# EAGLE design 3yp_node (EAGLE 9.5.2)
DOC_NUM: 1; REV: 1A
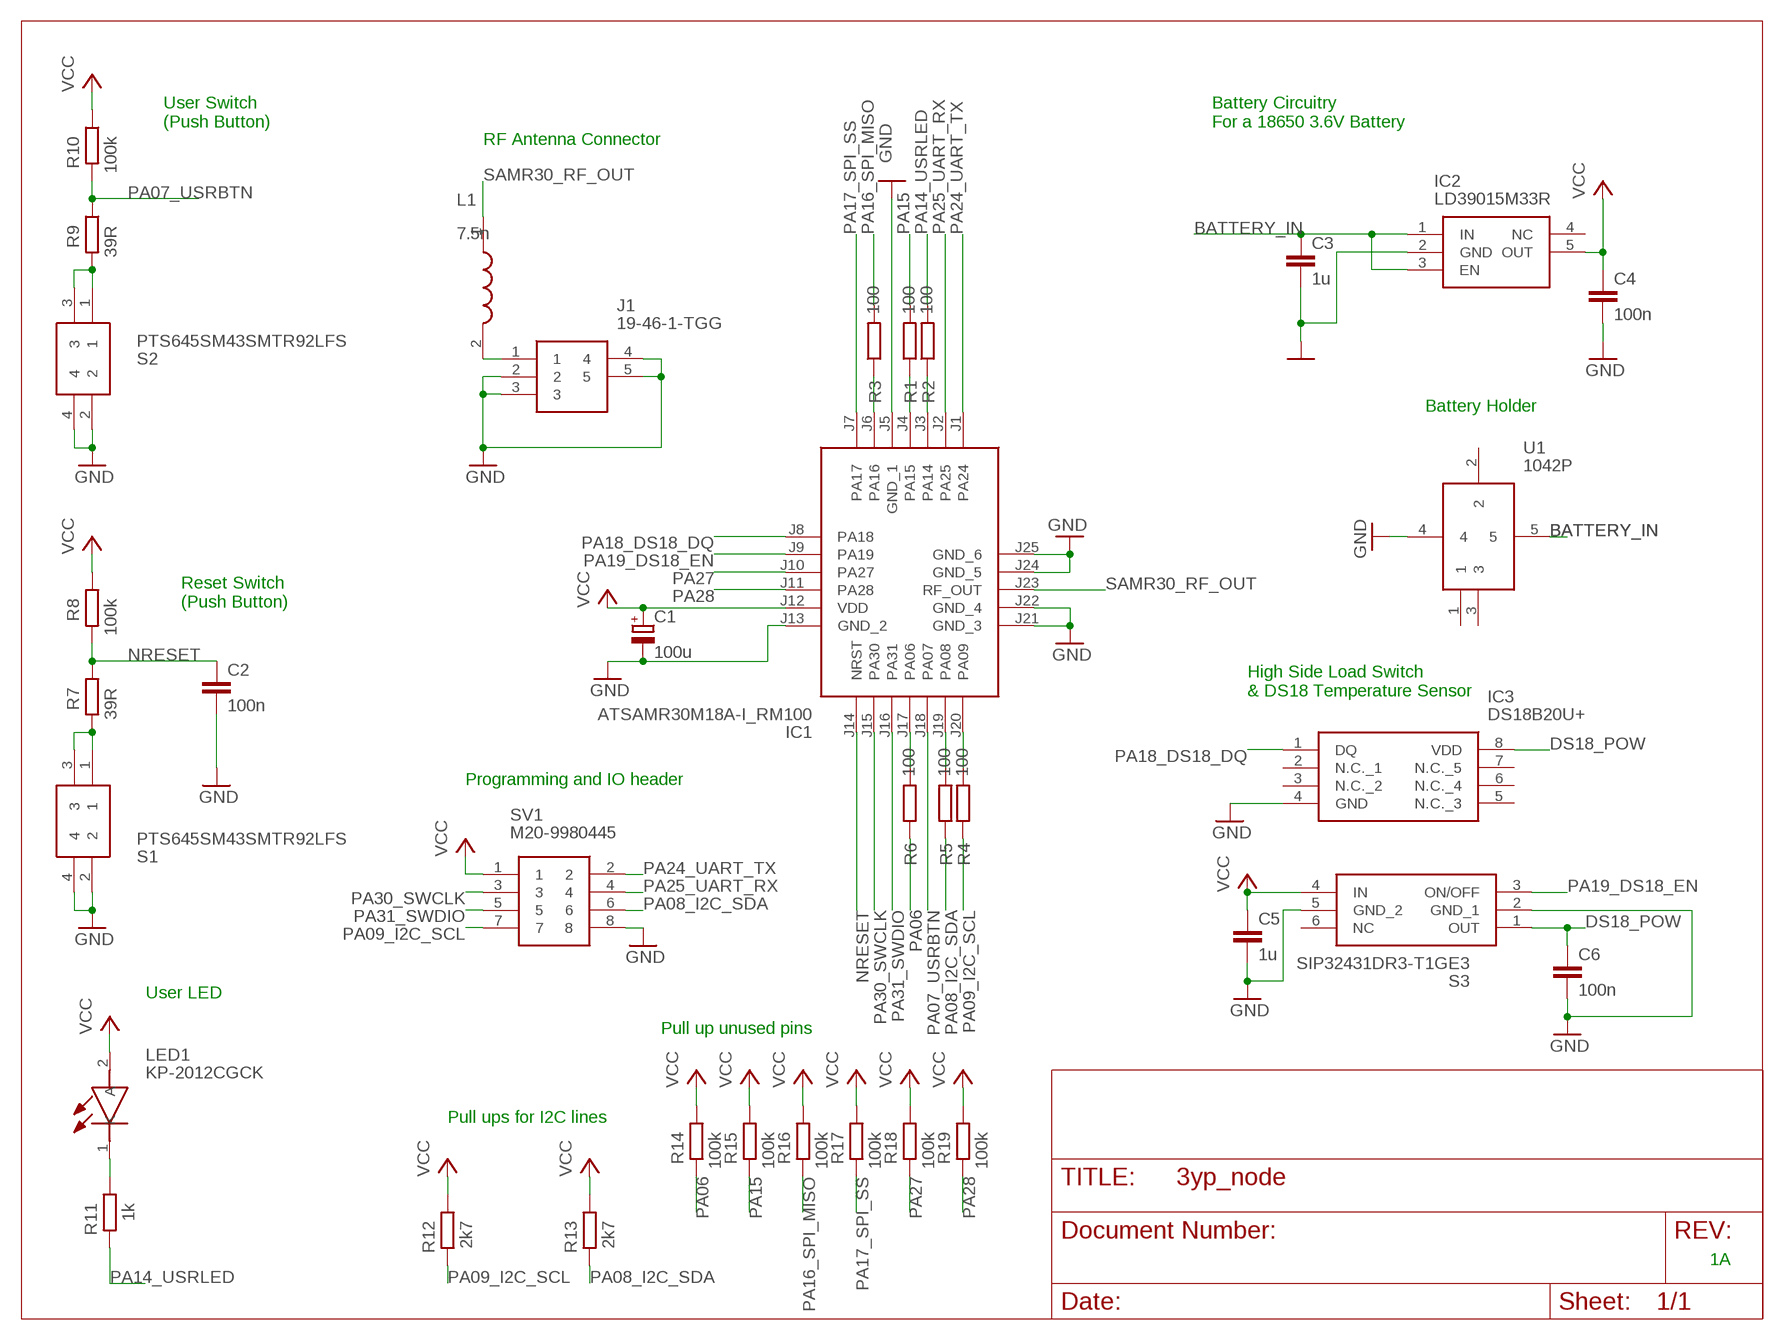
[diagram p0: schematic, sheet 1]

## Parts
C1  100u  CPOL-EUA/3216-18W  [A/3216-18W]
C2  100n  C-EUC0805  [C0805]
C3  1u  C-EUC0805  [C0805]
C4  100n  C-EUC0805  [C0805]
C5  1u  C-EUC0805  [C0805]
C6  100n  C-EUC0805  [C0805]
IC1  ATSAMR30M18A-I_RM100  [ATSAMR30M18AIRM100]
IC2  LD39015M33R  [SOT95P280X145-5N]
IC3  DS18B20U+  [SOP65P490X110-8N]
J1  19-46-1-TGG  [19-46-1-TGG_1]
L1  7.5n  MHQ1005P10NJT  [INDC1006X60N]
LED1  KP-2012CGCK  [LEDC2012X110N]
R1  100  R-EU_R0603  [R0603]
R2  100  R-EU_R0603  [R0603]
R3  100  R-EU_R0603  [R0603]
R4  100  R-EU_R0603  [R0603]
R5  100  R-EU_R0603  [R0603]
R6  100  R-EU_R0603  [R0603]
R7  39R  R-EU_R0603  [R0603]
R8  100k  R-EU_R0603  [R0603]
R9  39R  R-EU_R0603  [R0603]
R10  100k  R-EU_R0603  [R0603]
R11  1k  R-EU_R0603  [R0603]
R12  2k7  R-EU_R0603  [R0603]
R13  2k7  R-EU_R0603  [R0603]
R14  100k  R-EU_R0603  [R0603]
R15  100k  R-EU_R0603  [R0603]
R16  100k  R-EU_R0603  [R0603]
R17  100k  R-EU_R0603  [R0603]
R18  100k  R-EU_R0603  [R0603]
R19  100k  R-EU_R0603  [R0603]
S1  PTS645SM43SMTR92LFS  [PTS645(SMT)]
S2  PTS645SM43SMTR92LFS  [PTS645(SMT)]
S3  SIP32431DR3-T1GE3  [SOT65P210X110-6N]
SV1  M20-9980445  [HDRV8W64P254_2X4_1016X508X868P]
U1  1042P  [1042P]

## Nets
BATTERY_IN: C3.1 IC2.1(IN) IC2.3(EN) U1.5
DS18_POW: C6.1 IC3.8(VDD) S3.1(OUT)
GND: C1.- C2.2 C3.2 C4.2 C5.2 C6.2 IC1.J5(GND_1) IC1.J13(GND_2) IC1.J21(GND_3) IC1.J22(GND_4) IC1.J24(GND_5) IC1.J25(GND_6) IC2.2(GND) IC3.4(GND) J1.2 J1.3 J1.4 J1.5 S1.2 S1.4 S2.2 S2.4 S3.2(GND_1) S3.5(GND_2) SV1.8 U1.4
N$1: R9.2 S2.1 S2.3
N$2: IC1.J4(PA15) R1.1
N$3: IC1.J6(PA16) R3.1
N$4: IC1.J3(PA14) R2.1
N$5: IC1.J17(PA06) R6.2
N$6: IC1.J19(PA08) R5.2
N$7: IC1.J20(PA09) R4.2
N$8: R7.2 S1.1 S1.3
N$9: LED1.1(K) R11.1
N$10: J1.1 L1.2
NRESET: C2.1 IC1.J14(NRST) R7.1 R8.2
PA06: R6.1 R14.2
PA07_USRBTN: IC1.J18(PA07) R9.1 R10.2
PA08_I2C_SDA: R5.1 R13.2 SV1.6
PA09_I2C_SCL: R4.1 R12.2 SV1.7
PA14_USRLED: R2.2 R11.2
PA15: R1.2 R15.2
PA16_SPI_MISO: R3.2 R16.2
PA17_SPI_SS: IC1.J7(PA17) R17.2
PA18_DS18_DQ: IC1.J8(PA18) IC3.1(DQ)
PA19_DS18_EN: IC1.J9(PA19) S3.3(ON/OFF)
PA24_UART_TX: IC1.J1(PA24) SV1.2
PA25_UART_RX: IC1.J2(PA25) SV1.4
PA27: IC1.J10(PA27) R18.2
PA28: IC1.J11(PA28) R19.2
PA30_SWCLK: IC1.J15(PA30) SV1.3
PA31_SWDIO: IC1.J16(PA31) SV1.5
SAMR30_RF_OUT: IC1.J23(RF_OUT) L1.1
VCC: C1.+ C4.1 C5.1 IC1.J12(VDD) IC2.5(OUT) LED1.2(A) R8.1 R10.1 R12.1 R13.1 R14.1 R15.1 R16.1 R17.1 R18.1 R19.1 S3.4(IN) SV1.1
Unconnected: IC2.4(NC) IC3.2(N.C._1) IC3.3(N.C._2) IC3.5(N.C._3) IC3.6(N.C._4) IC3.7(N.C._5) S3.6(NC) U1.1 U1.2 U1.3

## Notes on the sheet
- User Switch
  (Push Button)
- Battery Circuitry
  For a 18650 3.6V Battery
- RF Antenna Connector
- Battery Holder
- Reset Switch 
  (Push Button)
- High Side Load Switch
  & DS18 Temperature Sensor
- Programming and IO header
- User LED
- Pull up unused pins
- Pull ups for I2C lines

## Library data of the parts
C1 = rcl:CPOL-EU: POLARIZED CAPACITOR, European symbol; SPICEPREFIX: C
C2-C6 = rcl:C-EU: CAPACITOR, European symbol; SPICEPREFIX: C
IC1 = SamacSys_Parts:ATSAMR30M18A-I_RM100: Microchip Technology, ATSAMR30M18A-I/RM1 Source: Datasheet <http://www.mouser.com/datasheet/2/268/70005384A-1532404.pdf>; DESCRIPTION: Microchip Technology, ATSAMR30M18A-I/RM1; HEIGHT: 2.1mm; MANUFACTURER_NAME: Microchip; MANUFACTURER_PART_NUMBER: ATSAMR30M18A-I/RM100; MOUSER_PART_NUMBER: 556-AMR30M18AIRM100; MOUSER_PRICE-STOCK: https://www.mouser.com/Search/Refine.aspx?Keyword=556-AMR30M18AIRM100; RS_PART_NUMBER: 1840450; RS_PRICE-STOCK: http://uk.rs-online.com/web/p/products/1840450
IC2 = SamacSys_Parts:LD39015M33R: LD39015M33R, Low Dropout Voltage Regulator, 150mA, 3.3 V +/-2%, 1.5 5.5 Vin, 5-Pin SOT-23 Source: Datasheet <http://www.st.com/web/en/resource/technical/document/datasheet/CD00173477.pdf>; ALLIED_NUMBER: 70521225; ALLIED_PRICE-STOCK: http://www.alliedelec.com/stmicroelectronics-ld39015m33r/70521225/; DESCRIPTION: LD39015M33R, Low Dropout Voltage Regulator, 150mA, 3.3 V +/-2%, 1.5 5.5 Vin, 5-Pin SOT-23; HEIGHT: 1.45mm; MANUFACTURER_NAME: STMicroelectronics; MANUFACTURER_PART_NUMBER: LD39015M33R; MOUSER_PART_NUMBER: 511-LD39015M33R; MOUSER_PRICE-STOCK: https://www.mouser.com/Search/Refine.aspx?Keyword=511-LD39015M33R; RS_PART_NUMBER: 7958965P; RS_PRICE-STOCK: http://uk.rs-online.com/web/p/products/7958965P
IC3 = SamacSys_Parts:DS18B20U+: Board Mount Temperature Sensors Prgmble Resolution 1-Wire Parasite Pwr Source: Datasheet <https://componentsearchengine.com/Datasheets/1/DS18B20U .pdf>; DESCRIPTION: Board Mount Temperature Sensors Prgmble Resolution 1-Wire Parasite Pwr; HEIGHT: 1.1mm; MANUFACTURER_NAME: Maxim Integrated; MANUFACTURER_PART_NUMBER: DS18B20U+; MOUSER_PART_NUMBER: 700-DS18B20U; MOUSER_PRICE-STOCK: https://www.mouser.com/Search/Refine.aspx?Keyword=700-DS18B20U
J1 = SamacSys_Parts:19-46-1-TGG: MULTICOMP - 19-46-1-TGG - RF COAXIAL, SMA, STRAIGHT JACK, 50OHM Source: Datasheet <http://www.farnell.com/datasheets/1661858.pdf>; DESCRIPTION: MULTICOMP - 19-46-1-TGG - RF COAXIAL, SMA, STRAIGHT JACK, 50OHM; HEIGHT: mm; MANUFACTURER_NAME: MULTICOMP; MANUFACTURER_PART_NUMBER: 19-46-1-TGG
L1 = SamacSys_Parts:MHQ1005P10NJT: TDK MHQ1005P Series 10 nH +/-5% Ceramic Multilayer SMD Inductor, 0402 Case, SRF: 4.6GHz Q: 23 500mA dc 190m Rdc Source: Datasheet <https://product.tdk.com/info/en/catalog/datasheets/inductor_commercial_high-frequency_mhq1005p_en.pdf>; DESCRIPTION: TDK MHQ1005P Series 10 nH +/-5% Ceramic Multilayer SMD Inductor, 0402 Case, SRF: 4.6GHz Q: 23 500mA dc 190m Rdc; HEIGHT: 0.6mm; MANUFACTURER_NAME: TDK; MANUFACTURER_PART_NUMBER: MHQ1005P10NJT; MOUSER_PART_NUMBER: 810-MHQ1005P10NJT; MOUSER_PRICE-STOCK: https://www.mouser.com/Search/Refine.aspx?Keyword=810-MHQ1005P10NJT; RS_PART_NUMBER: 7958243P; RS_PRICE-STOCK: http://uk.rs-online.com/web/p/products/7958243P
LED1 = SamacSys_Parts:KP-2012CGCK: Green Chip LED 2.0x1.25mm Kingbright KP-2012CGCK Green LED, 570 nm, 2012 (0805), Rectangle Lens SMD Package Source: Datasheet <https://componentsearchengine.com/Datasheets/2/KP-2012CGCK.pdf>; DESCRIPTION: Green Chip LED 2.0x1.25mm Kingbright KP-2012CGCK Green LED, 570 nm, 2012 (0805), Rectangle Lens SMD Package; HEIGHT: 1.1mm; MANUFACTURER_NAME: Kingbright; MANUFACTURER_PART_NUMBER: KP-2012CGCK; MOUSER_PART_NUMBER: N/A; MOUSER_PRICE-STOCK: https://www.mouser.com/Search/Refine.aspx?Keyword=N%2FA; RS_PART_NUMBER: 8610037P; RS_PRICE-STOCK: http://uk.rs-online.com/web/p/products/8610037P
R1-R19 = rcl:R-EU_: RESISTOR, European symbol; SPICEPREFIX: R
S1 S2 = SamacSys_Parts:PTS645SM43SMTR92LFS: C & K COMPONENTS - PTS645SM43SMTR92LFS - SWITCH, SPST, 0.05A, 12VDC, SMD, 4.3MM Source: Datasheet <https://componentsearchengine.com/Datasheets/1/PTS645SM43SMTR92LFS.pdf>; DESCRIPTION: C & K COMPONENTS - PTS645SM43SMTR92LFS - SWITCH, SPST, 0.05A, 12VDC, SMD, 4.3MM; HEIGHT: mm; MANUFACTURER_NAME: C & K COMPONENTS; MANUFACTURER_PART_NUMBER: PTS645SM43SMTR92LFS; MOUSER_PART_NUMBER: 611-PTS645SM43SMTR92; MOUSER_PRICE-STOCK: https://www.mouser.com/Search/Refine.aspx?Keyword=611-PTS645SM43SMTR92
S3 = SamacSys_Parts:SIP32431DR3-T1GE3: VISHAY - SIP32431DR3-T1GE3 - IC, LOAD SWITCH, 1.1V-5.5V, 1A, SC70 Source: Datasheet <https://www.vishay.com/docs/66597/sip32431.pdf>; DESCRIPTION: VISHAY - SIP32431DR3-T1GE3 - IC, LOAD SWITCH, 1.1V-5.5V, 1A, SC70; HEIGHT: 1.1mm; MANUFACTURER_NAME: Vishay; MANUFACTURER_PART_NUMBER: SIP32431DR3-T1GE3; MOUSER_PART_NUMBER: 781-SIP32431DR3-GE3; MOUSER_PRICE-STOCK: https://www.mouser.com/Search/Refine.aspx?Keyword=781-SIP32431DR3-GE3; RS_PART_NUMBER: 1807353; RS_PRICE-STOCK: http://uk.rs-online.com/web/p/products/1807353
SV1 = SamacSys_Parts:M20-9980445: M20 Header, Pin, Dil, Vertical, 4+4 W HARWIN M20 Series, 2.54mm Pitch 8 Way 2 Row Straight Pin Header, Through Hole, Solder Termination Source: Datasheet <https://componentsearchengine.com/Datasheets/1/M20-9980445.pdf>; ALLIED_NUMBER: R1052696; ALLIED_PRICE-STOCK: https://www.alliedelec.com/harwin-m20-9980445/R1052696/; DESCRIPTION: M20 Header, Pin, Dil, Vertical, 4+4 W HARWIN M20 Series, 2.54mm Pitch 8 Way 2 Row Straight Pin Header, Through Hole, Solder Termination; HEIGHT: 8.68mm; MANUFACTURER_NAME: HARWIN; MANUFACTURER_PART_NUMBER: M20-9980445; MOUSER_PART_NUMBER: 855-M20-9980445; MOUSER_PRICE-STOCK: https://www.mouser.com/Search/Refine.aspx?Keyword=855-M20-9980445; RS_PART_NUMBER: 6812941P; RS_PRICE-STOCK: http://uk.rs-online.com/web/p/products/6812941P
U1 = SamacSys_Parts:1042P: KEYSTONE - 1042P - BATTERY HOLDER, 18650, SMD Source: Datasheet <https://componentsearchengine.com/Datasheets/1/1042P.pdf>; DESCRIPTION: KEYSTONE - 1042P - BATTERY HOLDER, 18650, SMD; HEIGHT: 14mm; MANUFACTURER_NAME: Keystone Electronics; MANUFACTURER_PART_NUMBER: 1042P; MOUSER_PART_NUMBER: 534-1042P; MOUSER_PRICE-STOCK: https://www.mouser.com/Search/Refine.aspx?Keyword=534-1042P

## Board
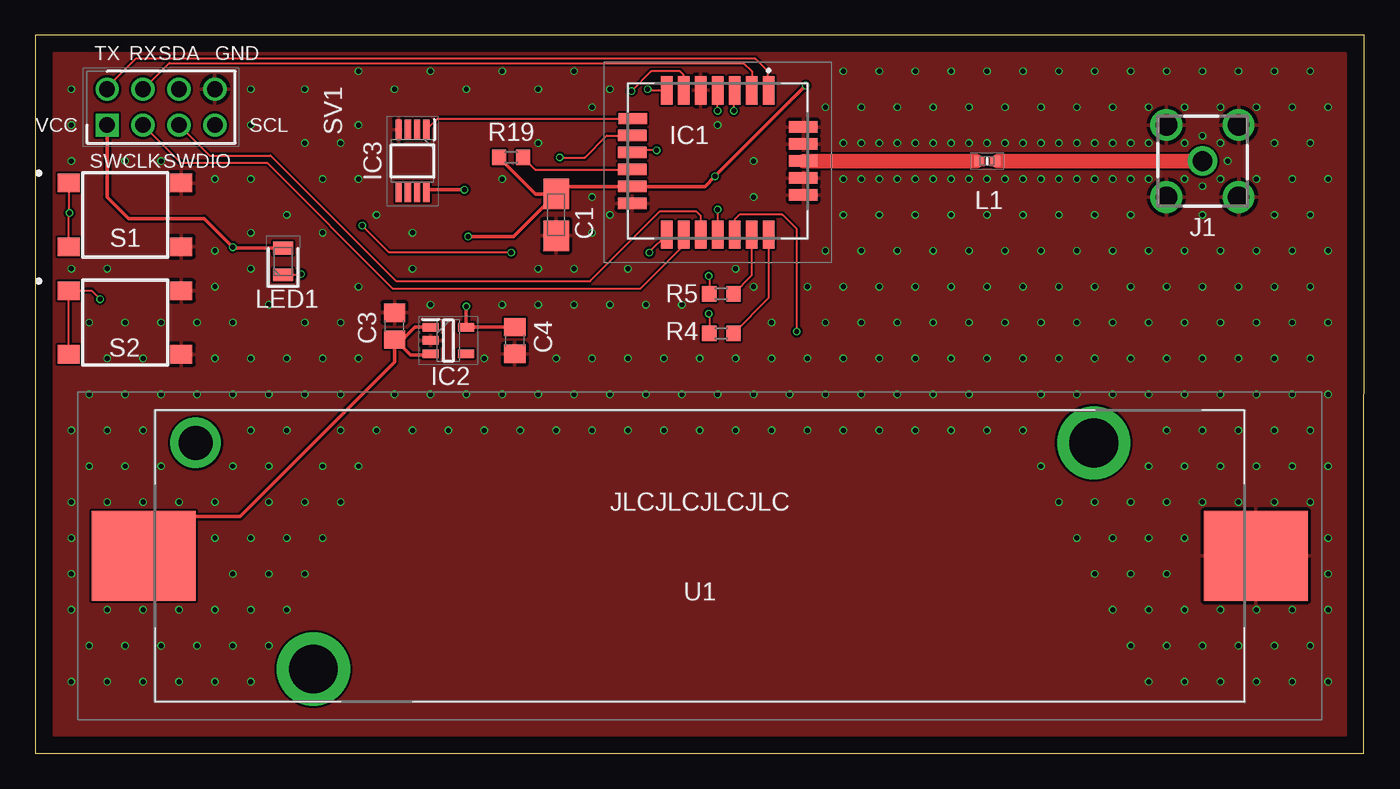
[diagram p1: board, top side]
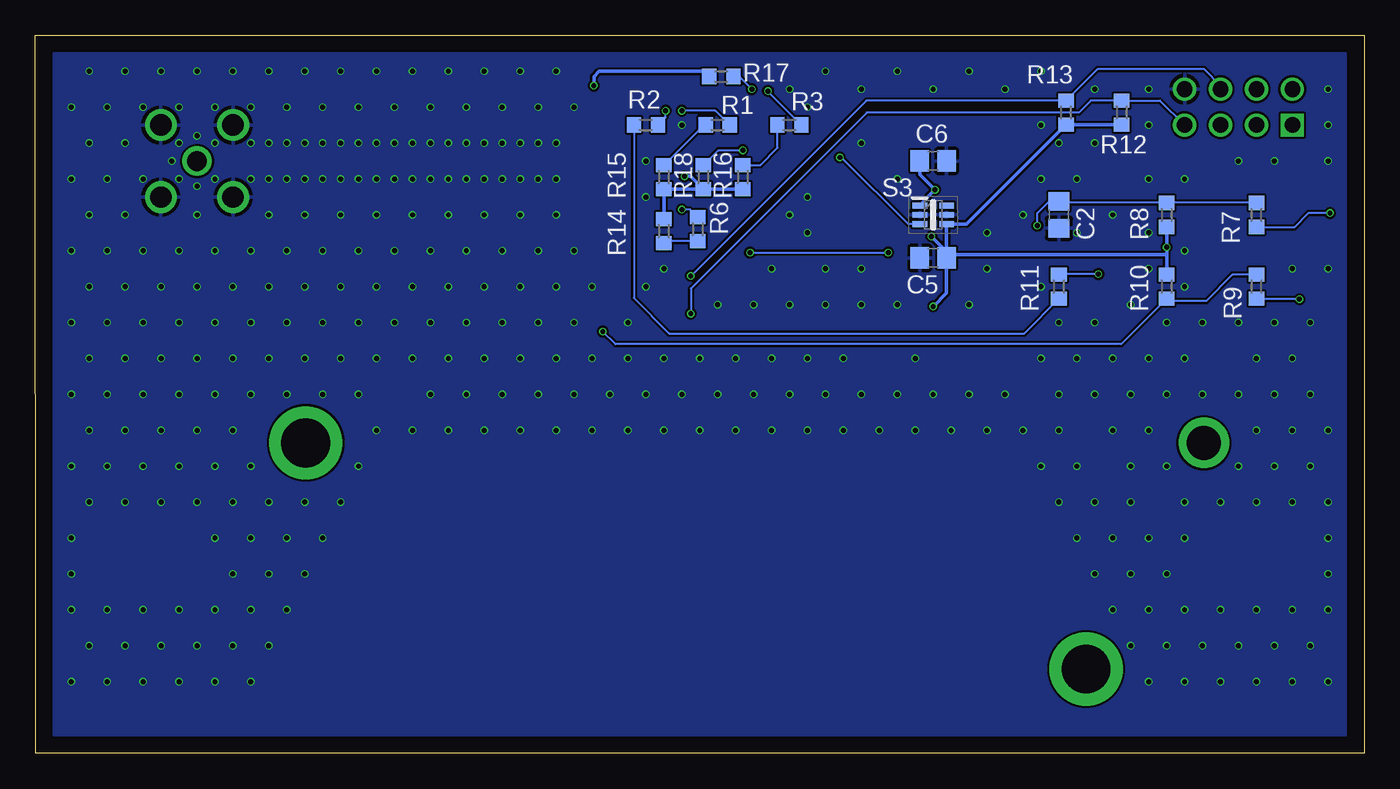
[diagram p2: board, bottom side, seen from below]

Size 93.98 x 50.8 mm. Coordinates in mm from the lower left corner, seen from the top.
Outline: 0,0 93.96,0 93.98,50.8 0,50.8 0,0
Copper layers (1*16): Top 0.035559375mm / dielectric 1.6mm / Bottom 0.035559375mm
Design rules "jlcpcb2layer": minimum track width 5mil, minimum drill 12mil, track to track 5mil, track to pad 5mil, pad to pad 5mil, via to via 5mil, smd to smd 5mil, copper to edge 8mil, drill to drill 6mil, minimum pad ring 5mil, minimum via ring 3mil, stop-mask expansion 2.5mil, vias tented up to drill 0mil, thermal gap 10mil
tRestrict: area 66.8,41.6 to 67.8,42.2

### Footprints (pad centres in the part's own frame; a part is rotated, then mirrored left to right if it is on the bottom)
A/3216-18W = smd 2.15 x 1.8: + 1.475,0; - -1.475,0
C0805 = smd 1.3 x 1.5: 1 -0.95,0; 2 0.95,0
ATSAMR30M18AIRM100 = smd 0.8 x 2: J1 -3.6,-5; J2 -2.4,-5; J3 -1.2,-5; J4 0,-5; J5 1.2,-5; J6 2.4,-5; J7 3.6,-5; J14 3.6,5.2; J15 2.4,5.2; J16 1.2,5.2; J17 0,5.2; J18 -1.2,5.2; J19 -2.4,5.2; J20 -3.6,5.2 | smd 2 x 0.8: J8 6,-3; J9 6.05,-1.8; J10 6.05,-0.6; J11 6.05,0.6; J12 6.05,1.8; J13 6.05,3; J21 -6.05,2.4; J22 -6.05,1.2; J23 -6.05,0; J24 -6.05,-1.2; J25 -6.05,-2.4
SOT95P280X145-5N = smd 1.15 x 0.6: 1 -1.25,0.95; 2 -1.25,0; 3 -1.25,-0.95; 4 1.25,-0.95; 5 1.25,0.95
SOP65P490X110-8N = smd 1.425 x 0.45: 1 -2.212,0.975; 2 -2.212,0.325; 3 -2.212,-0.325; 4 -2.212,-0.975; 5 2.212,-0.975; 6 2.212,-0.325; 7 2.212,0.325; 8 2.212,0.975
19-46-1-TGG_1 = drill 1.4 pad 2.1: 1 0,0 | drill 1.5 pad 2.25: 2 -2.55,2.55; 3 2.55,2.55; 4 -2.55,-2.55; 5 2.55,-2.55
INDC1006X60N = smd 0.7 x 0.7: 1 -0.55,0; 2 0.55,0
LEDC2012X110N = smd 0.9 x 1.4: 1 -0.95,0; 2 0.95,0
R0603 = smd 1 x 1.1: 1 -0.85,0; 2 0.85,0
PTS645(SMT) = smd 1.55 x 1.3: 1 -3.975,2.25; 2 3.975,2.25; 3 -3.975,-2.25; 4 3.975,-2.25
SOT65P210X110-6N = smd 1.05 x 0.4: 1 -0.95,0.65; 2 -0.95,0; 3 -0.95,-0.65; 4 0.95,-0.65; 5 0.95,0; 6 0.95,0.65
HDRV8W64P254_2X4_1016X508X868P = drill 1.1 pad 1.65 square: 1 0,0 | drill 1.1 pad 1.65: 2 0,2.54; 3 2.54,0; 4 2.54,2.54; 5 5.08,0; 6 5.08,2.54; 7 7.62,0; 8 7.62,2.54
1042P = drill 3.45 pad 5.175: 1 -27.87,-8; 2 27.33,8 | drill 2.39 pad 3.585: 3 35.66,-8 | smd 7.34 x 6.35: 4 -39.33,0; 5 39.33,0

### Placement (x,y rotation side)
C1  36.83,38.1 90 top
C2  21.59,38.1 270 bottom
C3  25.4,30.23 90 top
C4  33.91,29.21 270 top
C5  30.48,35.05 180 bottom
C6  30.48,41.91 0 bottom
IC1  48.26,41.91 180 top
IC2  29.21,29.21 0 top
IC3  26.67,41.91 270 top
J1  82.55,41.91 0 top
L1  67.31,41.91 0 top
LED1  17.53,34.8 90 top
R1  45.72,44.45 180 bottom
R2  50.8,44.45 180 bottom
R3  40.64,44.45 180 bottom
R4  48.51,29.72 0 top
R5  48.51,32.51 0 top
R6  47.12,37.08 90 bottom
R7  7.62,38.1 270 bottom
R8  13.97,38.1 90 bottom
R9  7.62,33.02 270 bottom
R10  13.97,33.02 270 bottom
R11  21.59,33.02 270 bottom
R12  17.14,45.34 90 bottom
R13  21.08,45.34 90 bottom
R14  49.53,36.96 270 bottom
R15  49.53,40.77 90 bottom
R16  43.94,40.77 90 bottom
R17  45.47,47.88 0 bottom
R18  46.74,40.77 90 bottom
R19  33.66,42.16 0 top
S1  6.35,38.1 0 top
S2  6.35,30.48 0 top
S3  30.48,38.1 0 bottom
SV1  5.08,44.45 0 top
U1  46.99,13.97 180 top

### Tracks (layer width: path | path; a pad name or v marks a point on that pad's centre or on a via)
BATTERY_IN
  Top 0.254: C3.1 25.97,29.28 26.86,30.16 IC2.1 | C3.1 25.46,29.28 26.54,28.19 27.89,28.19 IC2.3 | U1.5 10.45,16.76 14.48,16.76 25.4,27.69 C3.1
DS18_POW  (via drill 0.35)
  Top 0.254: IC3.8 27.82,39.88 v30.35,39.88
  Bottom 0.254: C6.1 31.43,40.95 v30.35,39.88 31.43,38.8 S3.1
GND  (via drill 0.35)
  other vias: 57.15,48.26 59.69,48.26 62.23,48.26 64.77,48.26 67.31,48.26 69.85,48.26 72.39,48.26 74.93,48.26 77.47,48.26 80.01,48.26 82.55,48.26 85.09,48.26 87.63,48.26 90.17,48.26 71.12,35.56 73.66,35.56 76.2,35.56 78.74,35.56 81.28,35.56 83.82,35.56 86.36,35.56 88.9,35.56 91.44,35.56 55.88,45.72 58.42,45.72 60.96,45.72 63.5,45.72 66.04,45.72 68.58,45.72 71.12,45.72 73.66,45.72 76.2,45.72 78.74,45.72 81.28,45.72 81.28,43.18 83.82,43.18 83.82,40.64 81.28,40.64 83.82,45.72 86.36,45.72 88.9,45.72 91.44,45.72 90.17,43.18 87.63,43.18 88.9,40.64 91.44,40.64 90.17,38.1 87.63,38.1 86.36,40.64 82.55,38.1 77.47,38.1 74.93,38.1 72.39,38.1 69.85,38.1 67.31,38.1 64.77,38.1 62.23,38.1 59.69,38.1 57.15,38.1 57.15,43.18 57.15,40.64 58.42,40.64 59.69,40.64 60.96,40.64 62.23,40.64 63.5,40.64 64.77,40.64 66.04,40.64 67.31,40.64 68.58,40.64 69.85,40.64 71.12,40.64 72.39,40.64 73.66,40.64 74.93,40.64 76.2,40.64 77.47,40.64 78.74,40.64 78.74,43.18 77.47,43.18 76.2,43.18 74.93,43.18 73.66,43.18 72.39,43.18 71.12,43.18 69.85,43.18 68.58,43.18 67.31,43.18 66.04,43.18 64.77,43.18 63.5,43.18 62.23,43.18 60.96,43.18 59.69,43.18 58.42,43.18 90.17,33.02 87.63,33.02 85.09,33.02 82.55,33.02 80.01,33.02 77.47,33.02 74.93,33.02 72.39,33.02 69.85,33.02 91.44,30.48 91.44,25.4 91.44,20.32 91.44,15.24 91.44,12.7 91.44,10.16 91.44,5.08 88.9,5.08 90.17,7.62 88.9,10.16 90.17,17.78 87.63,17.78 88.9,20.32 88.9,25.4 88.9,30.48 90.17,27.94 90.17,22.86 87.63,22.86 87.63,27.94 86.36,30.48 86.36,25.4 86.36,20.32 85.09,17.78 86.36,10.16 86.36,5.08 87.63,7.62 85.09,7.62 85.09,22.86 85.09,27.94 83.82,30.48 83.82,25.4 83.82,20.32 81.28,30.48 81.28,25.4 81.28,20.32 81.28,15.24 81.28,10.16 81.28,5.08 82.55,7.62 83.82,5.08 83.82,10.16 82.55,17.78 82.55,22.86 82.55,27.94 80.01,27.94 80.01,22.86 80.01,17.78 80.01,12.7 80.01,7.62 78.74,5.08 77.47,7.62 76.2,10.16 78.74,10.16 77.47,12.7 78.74,15.24 77.47,17.78 78.74,20.32 78.74,25.4 78.74,30.48 69.85,22.86 69.85,27.94 71.12,30.48 71.12,25.4 71.12,20.32 72.39,17.78 73.66,15.24 74.93,12.7 76.2,15.24 74.93,17.78 76.2,25.4 74.93,27.94 76.2,30.48 73.66,30.48 72.39,27.94 73.66,25.4 77.47,27.94 67.31,33.02 67.31,27.94 67.31,22.86 62.23,22.86 64.77,22.86 59.69,22.86 57.15,22.86 54.61,22.86 55.88,25.4 58.42,25.4 60.96,25.4 63.5,25.4 66.04,25.4 64.77,27.94 66.04,30.48 64.77,33.02 62.23,33.02 63.5,30.48 62.23,27.94 59.69,33.02 59.69,27.94 60.96,30.48 58.42,30.48 55.88,35.56 54.61,33.02 55.88,30.48 57.15,27.94 54.61,27.94 57.15,33.02 52.07,22.86 52.07,27.94 52.07,30.48 53.34,25.4 50.8,25.4 49.53,27.94 49.53,22.86 46.99,27.94 46.99,22.86 48.26,25.4 44.45,22.86 39.37,22.86 36.83,27.94 35.56,25.4 36.83,22.86 39.37,27.94 40.64,25.4 38.1,25.4 41.91,22.86 43.18,25.4 41.91,27.94 44.45,27.94 45.72,25.4 45.72,31.75 43.18,31.75 40.64,31.75 38.1,31.75 35.56,31.75 33.02,31.75 31.75,27.94 33.02,25.4 3.81,25.4 3.81,20.32 3.81,7.62 2.54,5.08 2.54,10.16 2.54,12.7 2.54,15.24 2.54,17.78 2.54,22.86 5.08,22.86 5.08,17.78 5.08,10.16 5.08,5.08 7.62,10.16 7.62,5.08 6.35,7.62 11.43,7.62 8.89,7.62 10.16,10.16 10.16,5.08 12.7,5.08 15.24,5.08 12.7,10.16 13.97,7.62 12.7,15.24 15.24,15.24 15.24,10.16 13.97,12.7 16.51,7.62 16.51,12.7 16.51,17.78 21.59,17.78 20.32,15.24 19.05,12.7 17.78,10.16 17.78,15.24 19.05,17.78 20.32,20.32 22.86,20.32 21.59,22.86 24.13,22.86 25.4,25.4 27.94,25.4 30.48,25.4 31.75,22.86 34.29,22.86 29.21,22.86 26.67,22.86 21.59,25.4 19.05,25.4 16.51,25.4 13.97,25.4 11.43,25.4 6.35,25.4 7.62,22.86 6.35,20.32 7.62,17.78 8.89,20.32 10.16,17.78 12.7,17.78 13.97,20.32 16.51,20.32 15.24,22.86 17.78,22.86 8.89,25.4 3.81,30.48 5.08,27.94 6.35,30.48 7.62,27.94 8.89,30.48 11.43,30.48 12.7,27.94 15.24,27.94 17.78,27.94 20.32,27.94 22.86,27.94 19.05,30.48 13.97,30.48 22.86,33.02 12.7,33.02 12.7,35.56 15.24,36.83 15.24,34.29 20.32,36.83 16.51,31.75 5.08,34.29 2.54,34.29 27.94,31.75 26.67,34.29 26.67,36.83 24.13,38.1 22.86,40.64 20.32,40.64 15.24,40.64 12.7,40.64 17.78,38.1 19.05,43.18 21.59,43.18 2.54,41.91 2.54,44.45 2.54,46.99 6.35,41.91 8.89,41.91 15.24,44.45 15.24,46.99 19.05,46.99 25.4,46.99 22.86,48.26 27.94,48.26 30.48,46.99 33.02,48.26 35.56,46.99 38.1,48.26 35.56,34.29 38.1,34.29 39.37,36.83 39.37,39.37 41.91,34.29 39.37,45.72 40.64,46.99 50.8,41.91 50.8,39.37 82.55,43.69 82.55,40.13 84.33,41.91 58.42,35.56 60.96,35.56 63.5,35.56 66.04,35.56 68.58,35.56 68.58,30.48 21.59,30.48 22.86,44.45 33.02,40.64 35.56,43.18 40.64,38.1 48.26,44.45 49.53,34.29 50.8,33.02
  pour Top (isolate 0.152): 1.27,49.53 1.27,1.27 92.71,1.27 92.71,49.53
  pour Bottom (isolate 0.152): 92.71,49.53 92.71,1.27 1.27,1.27 1.27,49.53
N$1  (via drill 0.35)
  Top 0.152: S2.3 S2.1 3.97,32.73 v4.57,32.13
  Bottom 0.152: v4.57,32.13 7.58,32.13 R9.2
N$2  (via drill 0.35)
  Top 0.152: v48.26,45.47 IC1.J4
  Bottom 0.152: R1.1 45.89,45.47 v48.26,45.47
N$3  (via drill 0.35)
  Top 0.152: IC1.J6 45.85,46.92 45.85,48.01 45.59,48.26 43.56,48.26 v42.16,46.86
  Bottom 0.152: R3.1 42.16,46.82 v42.16,46.86
N$4  (via drill 0.35)
  Top 0.152: v49.4,45.47 49.4,46.85
  Top 0.254: 49.4,46.85 IC1.J3
  Bottom 0.152: R2.1 49.4,45 v49.4,45.47
N$5  (via drill 0.35)
  Top 0.152: v48.26,38.48 IC1.J17
  Bottom 0.152: R6.2 47.66,38.48 v48.26,38.48
N$6
  Top 0.152: IC1.J19 50.66,33.81 R5.2
N$7
  Top 0.152: IC1.J20 51.86,32.21 R4.2
N$8  (via drill 0.35)
  Top 0.152: S1.3 2.38,38.19 v2.41,38.23 2.38,38.27 S1.1
  Bottom 0.152: v2.41,38.23 3.94,38.23 4.95,37.21 7.58,37.21 R7.2
N$9  (via drill 0.35)
  Top 0.152: v18.8,33.91 18.73,33.85 LED1.1
  Bottom 0.152: v18.8,33.91 21.55,33.91 R11.1
N$10
  Top 0.406: 68.07,41.91 L1.2
  Top 1.016: J1.1 68.07,41.91
NRESET  (via drill 0.35)
  Top 0.152: IC1.J14 43.43,35.48 v43.43,35.43 | v33.66,35.43 25.02,35.43 v23.11,37.34
  Bottom 0.152: R7.1 R8.2 21.49,38.95 C2.1 22.29,39.05 23.11,38.23 v23.11,37.34 | v43.43,35.43 v33.66,35.43
PA06
  Bottom 0.152: R6.1 49.4,36.23 R14.2
PA07_USRBTN  (via drill 0.35)
  Top 0.152: v53.85,29.84 53.85,37.08 52.83,38.1 49.78,38.1 49.46,37.78 IC1.J18
  Bottom 0.152: R9.1 9.31,33.87 11.18,32 13.8,32 R10.2 17.18,28.96 52.96,28.96 v53.85,29.84
PA08_I2C_SDA  (via drill 0.35)
  Top 0.152: v47.62,33.78 47.66,33.74 R5.1
  Bottom 0.152: SV1.6 10.16,47.24 11.3,48.39 18.88,48.39 R13.2 35.22,46.19 v47.62,33.78
PA09_I2C_SCL  (via drill 0.35)
  Top 0.152: v47.62,31.11 47.66,31.08 R4.1
  Bottom 0.152: SV1.7 14.44,46.19 R12.2 19.34,46.19 20.19,45.34 35.18,45.34 47.62,32.89 v47.62,31.11
PA14_USRLED
  Bottom 0.152: R2.2 51.65,32.22 49.15,29.72 24.04,29.72 R11.2
PA15
  Bottom 0.152: R15.2 46.7,44.45 R1.2
PA16_SPI_MISO
  Bottom 0.152: R16.2 42.71,41.62 41.49,42.84 R3.2
PA17_SPI_SS  (via drill 0.35)
  Top 0.152: v43.31,46.99 43.39,46.91 IC1.J7
  Bottom 0.152: R17.2 44.2,47.88 v43.31,46.99
PA18_DS18_DQ
  Top 0.152: IC3.1 28.43,44.91 IC1.J8
PA19_DS18_EN  (via drill 0.35)
  Top 0.152: v37.08,42.16 38.86,42.16 40.41,43.71 IC1.J9
  Bottom 0.152: S3.3 32.24,37.45 36.96,42.16 v37.08,42.16
PA24_UART_TX
  Top 0.152: IC1.J1 51.82,46.95 51.82,48.26 50.93,49.15 7.11,49.15 5.08,47.12 SV1.2
PA25_UART_RX
  Top 0.152: SV1.4 9.47,48.84 50.09,48.84 50.67,48.26 50.67,46.92 IC1.J2
PA27  (via drill 0.35)
  Top 0.152: v43.94,42.67 42.37,42.67 IC1.J10
  Bottom 0.152: R18.2 45.68,42.67 v43.94,42.67
PA28
  Top 0.152: R19.2 35.36,41.31 IC1.J11
PA30_SWCLK
  Top 0.152: SV1.3 10.29,41.78 16.38,41.78 25.27,32.89 42.8,32.89 45.86,35.95 IC1.J15
PA31_SWDIO
  Top 0.152: SV1.5 12.32,42.29 16.64,42.29 25.53,33.4 39.24,33.4 44.2,38.35 46.74,38.35 47.06,38.03 IC1.J16
SAMR30_RF_OUT
  Top 0.406: 66.55,41.91 L1.1
  Top 1.016: IC1.J23 66.55,41.91
VCC  (via drill 0.35)
  Top 0.254: C4.1 IC2.5 30.48,30.18 v30.48,31.62 | SV1.1 5.08,39.37 6.6,37.85 11.94,37.85 v13.97,35.81 14.04,35.75 LED1.2 | C1.+ 33.83,36.58 v30.61,36.58 | C1.+ 37.37,40.11 IC1.J12 47.35,40.11 v48.07,40.83 v54.48,47.24 | R19.1 35.39,39.58 C1.+
  Bottom 0.254: R10.1 13.97,35.31 | 13.97,35.31 v13.97,35.81 R8.1 | C5.1 S3.4 28.12,37.45 R13.1 R12.1 | C5.1 29.28,35.31 13.97,35.31 | C5.1 29.53,32.57 v30.48,31.62 | v30.61,36.58 29.53,35.5 C5.1 | R14.1 R15.1 R18.1 | R18.1 R16.1 | v54.48,47.24 54.48,47.88 54.1,48.26 46.7,48.26 R17.1 | R18.1 47.65,40.83 v48.07,40.83

### Text on the board
tPlace: TX | RX | SDA | GND | VCC | SCL | SWCLK | SWDIO | JLCJLCJLCJLC